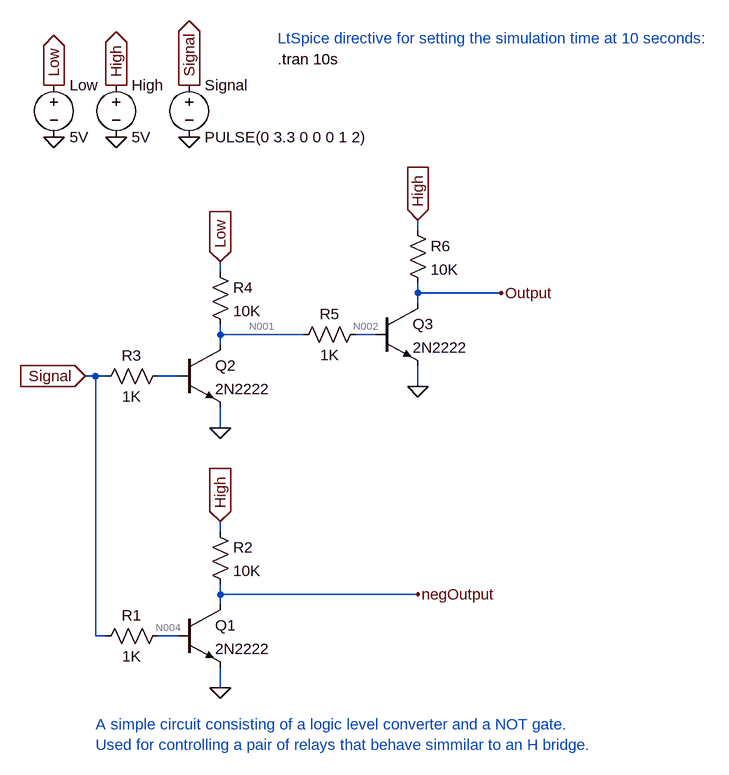
[diagram p0: schematic RelayControlCircuit.asc]
RelayControlCircuit.asc, the LTspice schematic file:
Version 4
SHEET 1 1620 680
WIRE 976 -176 976 -192
WIRE 672 -112 672 -128
WIRE 976 -80 976 -96
WIRE 1104 -80 976 -80
WIRE 976 -64 976 -80
WIRE 672 -16 672 -32
WIRE 800 -16 672 -16
WIRE 912 -16 880 -16
WIRE 672 0 672 -16
WIRE 480 48 464 48
WIRE 496 48 480 48
WIRE 608 48 576 48
WIRE 976 64 976 32
WIRE 672 128 672 96
WIRE 672 288 672 272
WIRE 672 384 672 368
WIRE 976 384 672 384
WIRE 672 400 672 384
WIRE 480 448 480 48
WIRE 496 448 480 448
WIRE 608 448 576 448
WIRE 672 528 672 496
FLAG 512 -320 0
FLAG 624 -320 0
FLAG 464 48 Signal
IOPIN 464 48 In
FLAG 512 -400 High
IOPIN 512 -400 Out
FLAG 624 -400 Signal
IOPIN 624 -400 Out
FLAG 1104 -80 Output
FLAG 672 -128 Low
IOPIN 672 -128 In
FLAG 672 128 0
FLAG 976 -192 High
IOPIN 976 -192 In
FLAG 976 64 0
FLAG 976 384 negOutput
FLAG 672 272 High
IOPIN 672 272 In
FLAG 672 528 0
FLAG 416 -320 0
FLAG 416 -400 Low
IOPIN 416 -400 Out
SYMBOL voltage 512 -416 R0
SYMATTR InstName High
SYMATTR Value 5V
SYMBOL voltage 624 -416 R0
WINDOW 123 0 0 Left 0
WINDOW 39 0 0 Left 0
SYMATTR InstName Signal
SYMATTR Value PULSE(0 3.3 0 0 0 1 2)
SYMBOL res 592 32 R90
WINDOW 0 0 56 VBottom 2
WINDOW 3 32 56 VTop 2
SYMATTR InstName R3
SYMATTR Value 1K
SYMBOL npn 608 0 R0
SYMATTR InstName Q2
SYMATTR Value 2N2222
SYMBOL res 656 -128 R0
SYMATTR InstName R4
SYMATTR Value 10K
SYMBOL res 896 -32 R90
WINDOW 0 0 56 VBottom 2
WINDOW 3 32 56 VTop 2
SYMATTR InstName R5
SYMATTR Value 1K
SYMBOL npn 912 -64 R0
SYMATTR InstName Q3
SYMATTR Value 2N2222
SYMBOL res 960 -192 R0
SYMATTR InstName R6
SYMATTR Value 10K
SYMBOL res 592 432 R90
WINDOW 0 0 56 VBottom 2
WINDOW 3 32 56 VTop 2
SYMATTR InstName R1
SYMATTR Value 1K
SYMBOL npn 608 400 R0
SYMATTR InstName Q1
SYMATTR Value 2N2222
SYMBOL res 656 272 R0
SYMATTR InstName R2
SYMATTR Value 10K
SYMBOL voltage 416 -416 R0
SYMATTR InstName Low
SYMATTR Value 5V
TEXT 760 -440 Left 2 !.tran 10s
TEXT 760 -472 Left 2 ;LtSpice directive for setting the simulation time at 10 seconds:
TEXT 480 584 Left 2 ;A simple circuit consisting of a logic level converter and a NOT gate.\nUsed for controlling a pair of relays that behave simmilar to an H bridge.

The netlist it stands for:
* RelayControlCircuit.asc
V§High High 0 5V
V§Signal Signal 0 PULSE(0 3.3 0 0 0 1 2)
R3 N003 Signal 1K
Q2 N001 N003 0 0 2N2222
R4 Low N001 10K
R5 N002 N001 1K
Q3 Output N002 0 0 2N2222
R6 High Output 10K
R1 N004 Signal 1K
Q1 negOutput N004 0 0 2N2222
R2 High negOutput 10K
V§Low Low 0 5V
.model NPN NPN
.model PNP PNP
.lib standard.bjt
.tran 10s
* LtSpice directive for setting the simulation time at 10 seconds:
* A simple circuit consisting of a logic level converter and a NOT gate.
* Used for controlling a pair of relays that behave simmilar to an H bridge.
.backanno
.end

* Results of the author's LTspice run, read from the files saved beside the schematic
* Operating Point, zero values left out:
*   V(high) = 5 V
*   V(n001) = 1.071 V
*   V(low) = 5 V
*   V(n002) = 677.7 mV
*   V(output) = 15.21 mV
*   V(n004) = 5.003 nV
*   V(negoutput) = 5 V
*   Ic(Q1) = 5.015 pA
*   Ib(Q1) = -5.003 pA
*   Ic(Q3) = 498.5 µA
*   Ib(Q3) = 392.9 µA
*   Ie(Q3) = -891.4 µA
*   Ic(Q2) = 1.084 pA
*   Ib(Q2) = -1.074 pA
*   I(R2) = 5.017 pA
*   I(R1) = 5.003 pA
*   I(R6) = 498.5 µA
*   I(R5) = -392.9 µA
*   I(R4) = 392.9 µA
*   I(R3) = 1.074 pA
*   I(Low) = -392.9 µA
*   I(Signal) = 6.077 pA
*   I(High) = -498.5 µA
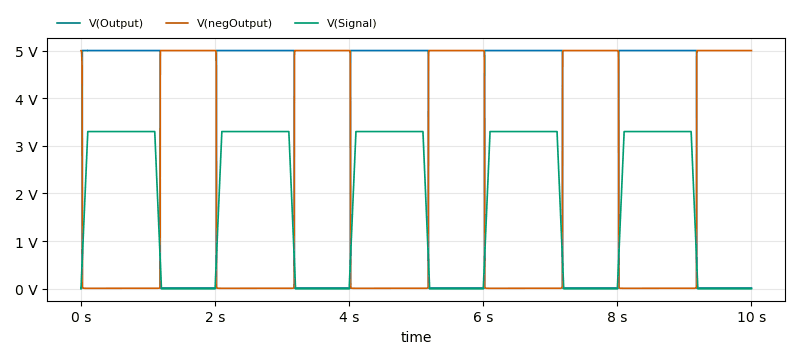
[diagram p1: Transient Analysis of RelayControlCircuit.asc, plotted from the saved traces]
* Transient Analysis, 1 run:
*   V(Output): min 15.21 mV, max 5.004 V, average 2.91 V, rms 3.81 V, last 15.21 mV
*   V(negOutput): min 9.765 mV, max 5 V, average 2.098 V, rms 3.233 V, last 5 V
*   V(Signal): min 0 V, max 3.3 V, average 1.815 V, rms 2.41 V, last 0 V